# EAGLE design amc7135-by-16-19mm-led-aux-driver-mk-1.0 (EAGLE 6.6.0)
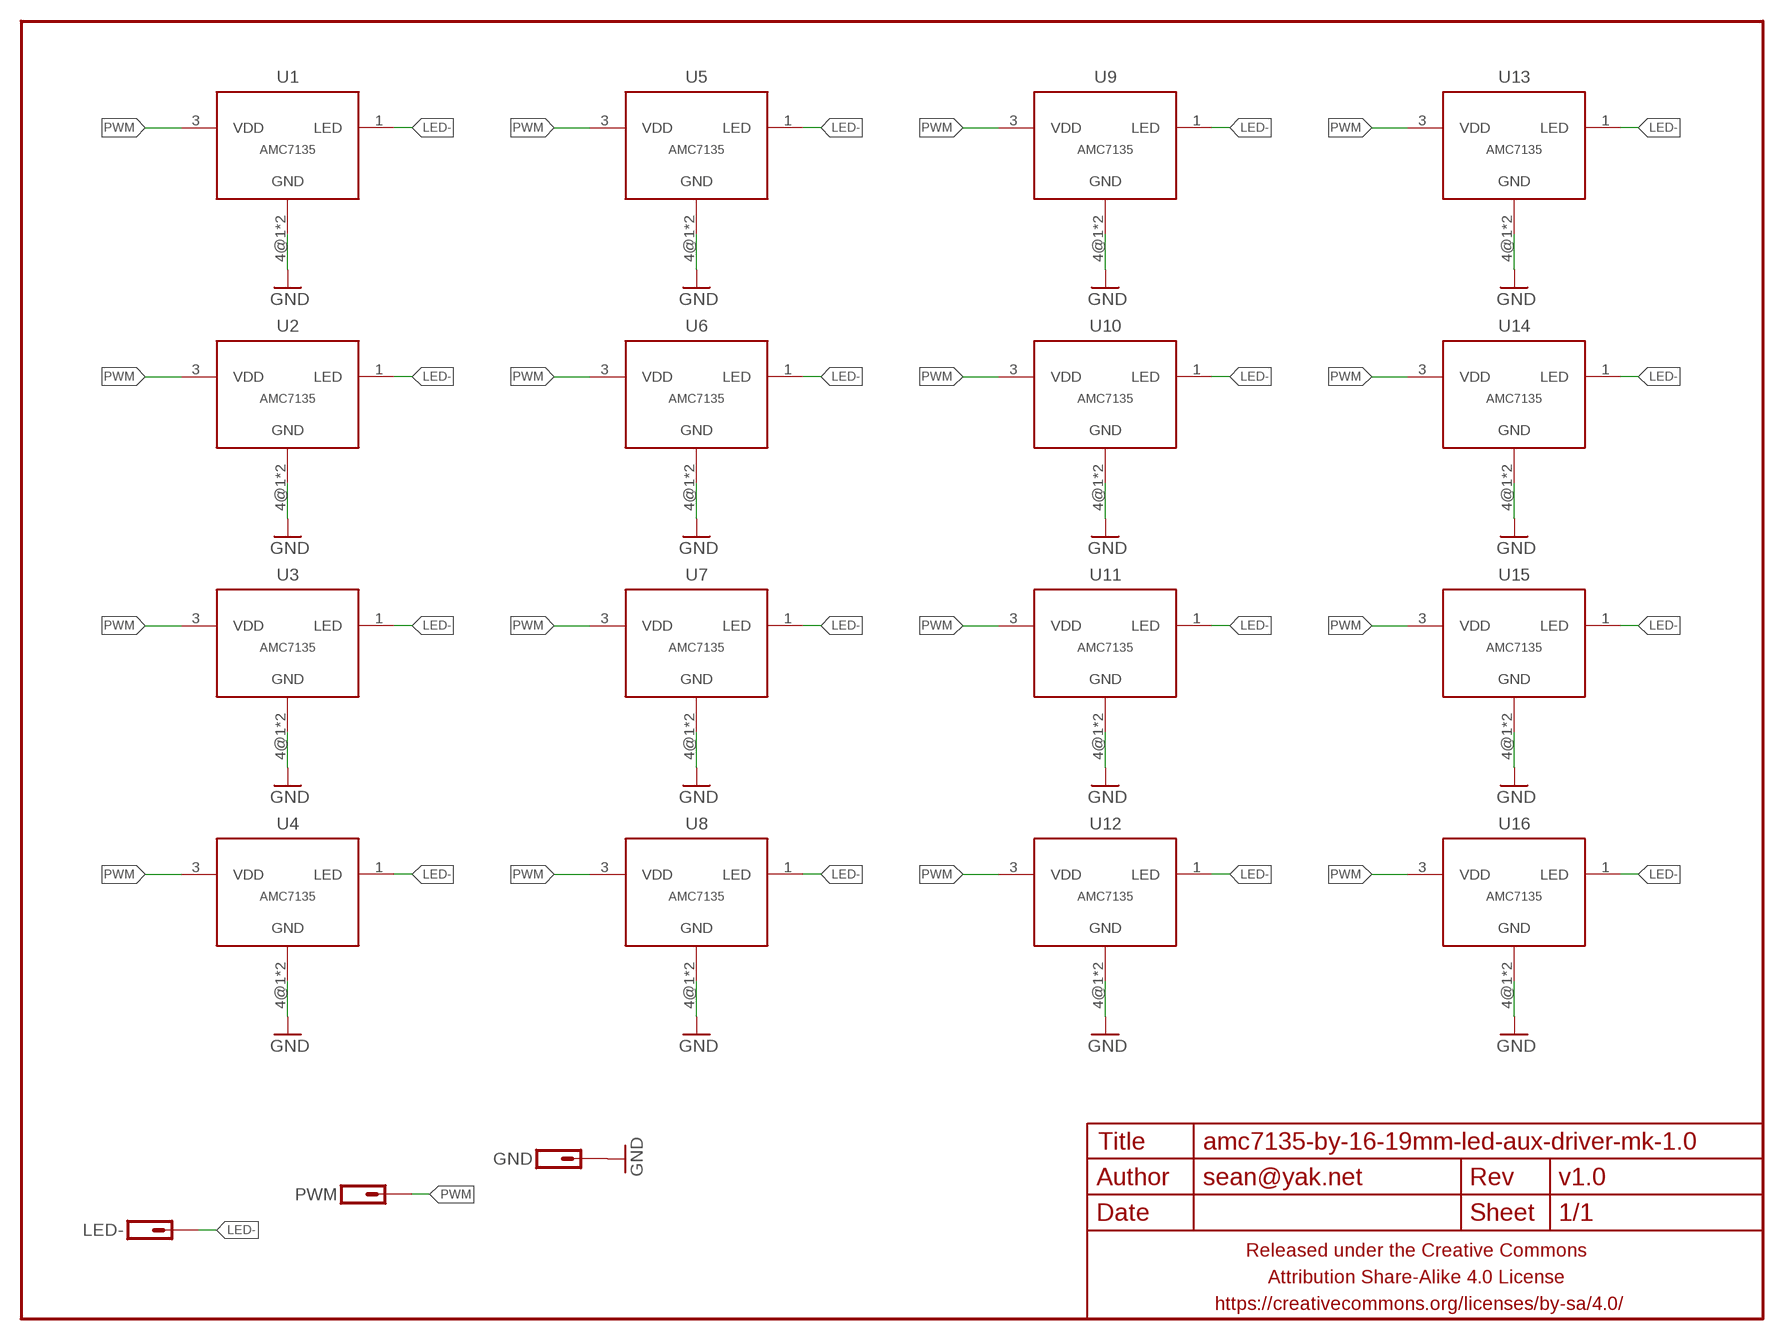
[diagram p0: schematic, sheet 1]

## Parts
FRAME1  FRAME-LETTERNO_PACKAGE  [DUMMY]
GND  M01PTH-1.2MM-NS  [1X01-1.2MM-NS]
LED-  M01PTH-1.2MM-NS  [1X01-1.2MM-NS]
PWM  M01PTH-0.9MM-CIR  [1X01-0.9MM-CIR]
U1  AMC7135  AMC7135ROUNDEDSMALER  [SOT89-ROUNDED-SMALLER]
U2  AMC7135  AMC7135ROUNDEDSMALER  [SOT89-ROUNDED-SMALLER]
U3  AMC7135  AMC7135ROUNDEDSMALER  [SOT89-ROUNDED-SMALLER]
U4  AMC7135  AMC7135ROUNDEDSMALER  [SOT89-ROUNDED-SMALLER]
U5  AMC7135  AMC7135ROUNDEDSMALER  [SOT89-ROUNDED-SMALLER]
U6  AMC7135  AMC7135ROUNDEDSMALER  [SOT89-ROUNDED-SMALLER]
U7  AMC7135  AMC7135ROUNDEDSMALER  [SOT89-ROUNDED-SMALLER]
U8  AMC7135  AMC7135ROUNDEDSMALER  [SOT89-ROUNDED-SMALLER]
U9  AMC7135  AMC7135ROUNDEDSMALER  [SOT89-ROUNDED-SMALLER]
U10  AMC7135  AMC7135ROUNDEDSMALER  [SOT89-ROUNDED-SMALLER]
U11  AMC7135  AMC7135ROUNDEDSMALER  [SOT89-ROUNDED-SMALLER]
U12  AMC7135  AMC7135ROUNDEDSMALER  [SOT89-ROUNDED-SMALLER]
U13  AMC7135  AMC7135ROUNDEDSMALER  [SOT89-ROUNDED-SMALLER]
U14  AMC7135  AMC7135ROUNDEDSMALER  [SOT89-ROUNDED-SMALLER]
U15  AMC7135  AMC7135ROUNDEDSMALER  [SOT89-ROUNDED-SMALLER]
U16  AMC7135  AMC7135ROUNDEDSMALER  [SOT89-ROUNDED-SMALLER]

## Nets
GND: GND.P$1 U1.4@1(GND) U1.4@2(GND) U2.4@1(GND) U2.4@2(GND) U3.4@1(GND) U3.4@2(GND) U4.4@1(GND) U4.4@2(GND) U5.4@1(GND) U5.4@2(GND) U6.4@1(GND) U6.4@2(GND) U7.4@1(GND) U7.4@2(GND) U8.4@1(GND) U8.4@2(GND) U9.4@1(GND) U9.4@2(GND) U10.4@1(GND) U10.4@2(GND) U11.4@1(GND) U11.4@2(GND) U12.4@1(GND) U12.4@2(GND) U13.4@1(GND) U13.4@2(GND) U14.4@1(GND) U14.4@2(GND) U15.4@1(GND) U15.4@2(GND) U16.4@1(GND) U16.4@2(GND)
LED-: LED-.P$1 U1.1(LED) U2.1(LED) U3.1(LED) U4.1(LED) U5.1(LED) U6.1(LED) U7.1(LED) U8.1(LED) U9.1(LED) U10.1(LED) U11.1(LED) U12.1(LED) U13.1(LED) U14.1(LED) U15.1(LED) U16.1(LED)
PWM: PWM.P$1 U1.3(VDD) U2.3(VDD) U3.3(VDD) U4.3(VDD) U5.3(VDD) U6.3(VDD) U7.3(VDD) U8.3(VDD) U9.3(VDD) U10.3(VDD) U11.3(VDD) U12.3(VDD) U13.3(VDD) U14.3(VDD) U15.3(VDD) U16.3(VDD)

## Library data of the parts
FRAME1 = a_parts:FRAME-LETTER: Schematic Frame Standard 8.5x11 US Letter frame; DESIGNER: sean@yak.net; VERSION: v1.0
GND LED- PWM = a_parts:M01: Header 1 Standard 1-pin 0.1" header. Use with straight break away headers (SKU : PRT-00116), right angle break away headers (PRT-00553), swiss pins (PRT-00743), machine pins (PRT-00117), and female headers (PRT-00115).
U1-U16 = a_parts:AMC7135

## Board
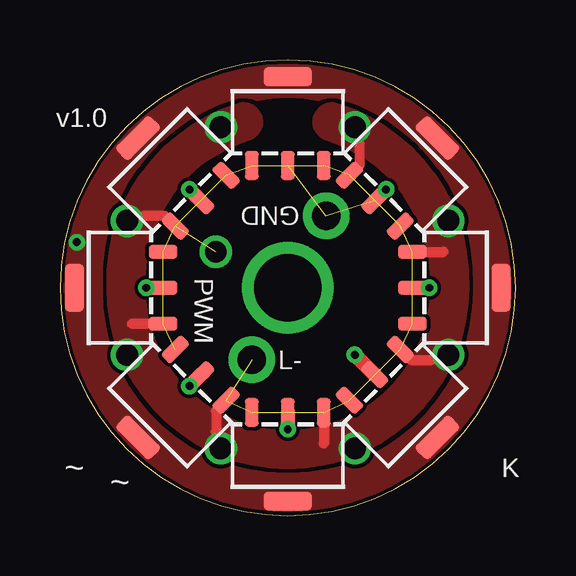
[diagram p1: board, top side]
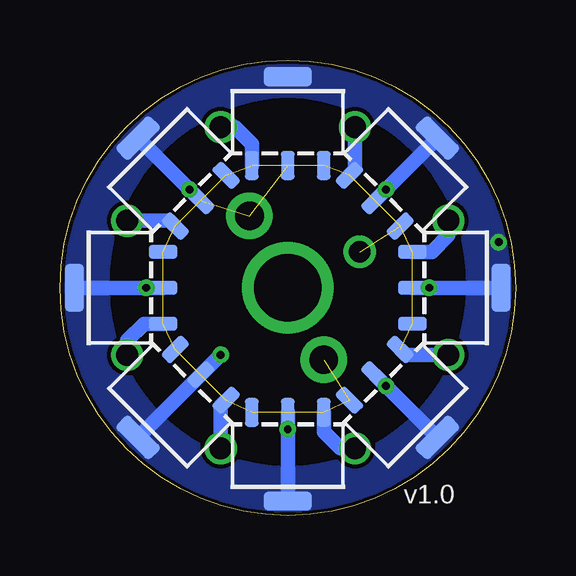
[diagram p2: board, bottom side, seen from below]

Size 19 x 19 mm. Coordinates in mm from the lower left corner, seen from the top.
Outline: 0,9.5 arc180 19,9.5 arc180 0,9.5
Copper layers (1*16): Top 0.0356mm / dielectric 1.5011mm / Bottom 0.0356mm
Design rules "LaenPCBOrder2 *": minimum track width 6mil, minimum drill 13mil, track to track 6mil, track to pad 6mil, pad to pad 6mil, via to via 6mil, smd to smd 6mil, copper to edge 6mil, drill to drill 6mil, minimum pad ring 7mil, minimum via ring 7mil, stop-mask expansion 3mil, vias tented up to drill 20mil, thermal gap 10mil

### Footprints (pad centres in the part's own frame; a part is rotated, then mirrored left to right if it is on the bottom)
1X01-1.2MM-NS = drill 1.2 pad 1.93: P$1 0,0
1X01-0.9MM-CIR = drill 0.9: P$1 0,0
SOT89-ROUNDED-SMALLER = smd 0.58 x 1.2: 1 -1.5,-1.8; 3 1.5,-1.8; 4@1 0,-1.8 | smd 2 x 0.8: 4@2 0,1.9

### Placement (x,y rotation side)
FRAME1  0,0 0 top
GND  11.1,12.5 0 top
LED-  8,6.5 0 top
PWM  6.5,11 0 top
U1  9.5,16.4 0 top
U2  14.4,14.4 315 top
U3  16.5,9.5 270 top
U4  14.4,4.6 225 top
U5  9.5,2.5 180 top
U6  4.6,4.6 135 top
U7  2.5,9.5 90 top
U8  4.6,14.4 45 top
U9  9.5,16.4 0 bottom
U10  14.4,14.4 45 bottom
U11  16.5,9.5 90 bottom
U12  14.4,4.6 135 bottom
U13  9.5,2.5 180 bottom
U14  4.6,4.6 225 bottom
U15  2.5,9.5 270 bottom
U16  4.6,14.4 315 bottom

### Tracks (layer width: path | path; a pad name or v marks a point on that pad's centre or on a via)
GND  (via drill 0.33)  (3 unrouted)
  Top 0.6: 6,6 U14.4@1 v5.4,5.4 | U12.4@1 | U12.4@1 v12.3,6.7 | U16.4@1 v5.4,13.6 | v5.4,13.6 | v3.6,9.5 U15.4@1 | U11.4@1 v15.4,9.5 | U10.4@1 v13.6,13.6 | U13.4@1 v9.5,3.6
  Bottom 0.6: U15.4@2 v3.6,9.5 U15.4@1 | U12.4@2 | U12.4@1 | U12.4@1 U12.4@2 | v12.3,6.7 U12.4@1 | U14.4@1 | U16.4@2 v5.4,13.6 U16.4@1 | U11.4@1 v15.4,9.5 U11.4@2 | U10.4@1 | U10.4@1 v13.6,13.6 U10.4@2 | U13.4@1 v9.5,3.6 U13.4@2 | U14.4@1 | U14.4@1 v5.4,5.4 | v5.4,5.4 | v5.4,5.4 U14.4@2
  other vias: 0.7,11.4
  pour Bottom (rank 6): 0,9.5 arc-90 9.5,19 arc-90 19,9.5 17,9.5 arc90 9.5,17.5 arc90 2,9.5
  pour Bottom (rank 6): 19,9.5 arc-90 9.5,0 arc-90 0,9.5 2,9.5 arc90 9.5,2 arc90 17,9.5
  pour Top (rank 6): 0,9.5 arc-90 9.5,19 arc-90 19,9.5 17,9.5 arc90 9.5,17.5 arc90 2,9.5
  pour Top (rank 6): 19,9.5 arc-90 9.5,0 arc-90 0,9.5 2,9.5 arc90 9.5,2 arc90 17,9.5
LED-  (via drill 0.9)  (2 unrouted)
  Top 0.406: U7.1 3,8 | U6.1 6.5,4.38 6.5,3.5 | U5.1 11,3 | U4.1 14.62,6.5 15.5,6.5 | U3.1 16,11 | U2.1 12.5,14.62 12.5,15.5 | U8.1 4.38,12.5 3.5,12.5
  Bottom 0.6: U14.1 4.58,6.7 v2.8,6.7 | U13.1 8,3.5 7.3,2.8 v6.7,2.8 | U12.1 12.3,4.58 v12.3,2.8 | U11.1 15.5,8 16.2,7.3 v16.2,6.7 | U10.1 14.42,12.3 v16.2,12.3 | U9.1 11,15.5 11.7,16.2 v12.3,16.2 | U16.1 6.7,14.42 v6.7,16.2 | U15.1 3.5,11 2.8,11.7 v2.8,12.3
  pour Top (rank 2, no thermals): 11.54,17.14 arc180 11.15,15.7 arc-75 15.5,9.5 17,9.5 arc75
  pour Top (rank 2, no thermals): 17,9.5 15.5,9.5 arc-90 9.5,3.5 9.5,2 arc90
  pour Top (rank 2, no thermals): 9.5,2 9.5,3.5 arc-90 3.5,9.5 2,9.5 arc90
  pour Top (rank 2, no thermals): 2,9.5 3.5,9.5 arc-75 7.85,15.7 arc180 7.46,17.14 arc75
N$2  (via drill 2.8 pad 3.81)
  other vias: 9.5,9.5
PWM  (16 unrouted)

### Text on the board
tPlace: GND | PWM | L- | ~ | K | ~